# Altium schematic sheet E16-PDB-7-LOAD_3.SchDoc
size A4
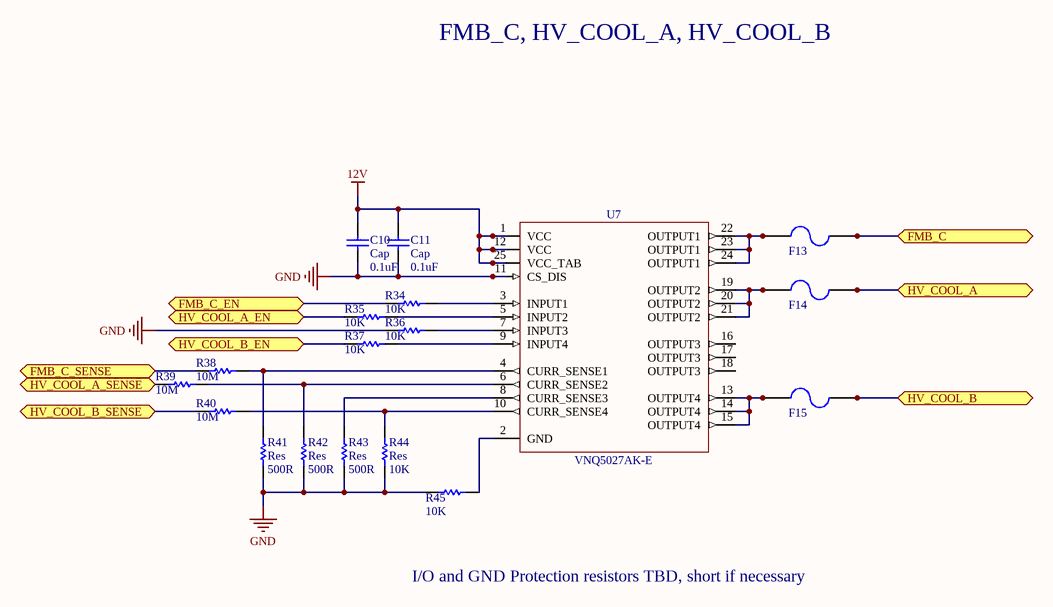
[diagram p0: E16-PDB-7-LOAD_3.SchDoc]

## Parts
C10  Cap  value 0.1uF  [C0805]
C11  Cap  value 0.1uF  [C0805]
F13  BK-6013  [BK-6013]  (value not drawn)
F14  BK-6013  [BK-6013]  (value not drawn)
F15  BK-6013  [BK-6013]  (value not drawn)
R34  value 10K  [2012[0805]]  (hidden comment: Res)
R35  value 10K  [2012[0805]]  (hidden comment: Res)
R36  value 10K  [2012[0805]]  (hidden comment: Res)
R37  value 10K  [2012[0805]]  (hidden comment: Res)
R38  value 10M  [2012[0805]]  (hidden comment: Res)
R39  value 10M  [2012[0805]]  (hidden comment: Res)
R40  value 10M  [2012[0805]]  (hidden comment: Res)
R41  Res  value 500R  [2012[0805]]
R42  Res  value 500R  [2012[0805]]
R43  Res  value 500R  [2012[0805]]
R44  Res  value 10K  [2012[0805]]
R45  value 10K  [2012[0805]]  (hidden comment: Res)
U7  MFG_PN: VNQ5027AK-E  [PowerSSO-24]  (hidden comment: U_VNQ5027AK-E)

## Ports
FMB_C, FMB_C_EN, FMB_C_SENSE, HV_COOL_A, HV_COOL_A_EN, HV_COOL_A_SENSE, HV_COOL_B, HV_COOL_B_EN, HV_COOL_B_SENSE

## Nets
12V: C10.2 C11.2 U7.1(VCC) U7.12(VCC) U7.25(VCC_TAB)
GND: C10.1 C11.1 R36.2 R41.1 R42.1 R43.1 R44.1 R45.2 U7.11(CS_DIS)
FMB_C: F13.3 F13.4 ; port FMB_C
FMB_C_EN: R34.2 ; port FMB_C_EN
FMB_C_SENSE: R38.2 ; port FMB_C_SENSE
HV_COOL_A: F14.3 F14.4 ; port HV_COOL_A
HV_COOL_A_EN: R35.2 ; port HV_COOL_A_EN
HV_COOL_A_SENSE: R39.2 ; port HV_COOL_A_SENSE
HV_COOL_B: F15.3 F15.4 ; port HV_COOL_B
HV_COOL_B_EN: R37.2 ; port HV_COOL_B_EN
HV_COOL_B_SENSE: R40.2 ; port HV_COOL_B_SENSE
NetF13_1: F13.1 F13.2 U7.22(OUTPUT1) U7.23(OUTPUT1) U7.24(OUTPUT1)
NetF14_1: F14.1 F14.2 U7.19(OUTPUT2) U7.20(OUTPUT2) U7.21(OUTPUT2)
NetF15_1: F15.1 F15.2 U7.13(OUTPUT4) U7.14(OUTPUT4) U7.15(OUTPUT4)
NetR34_1: R34.1 U7.3(INPUT1)
NetR35_1: R35.1 U7.5(INPUT2)
NetR36_1: R36.1 U7.7(INPUT3)
NetR37_1: R37.1 U7.9(INPUT4)
NetR38_1: R38.1 R41.2 U7.4(CURR_SENSE1)
NetR39_1: R39.1 R42.2 U7.6(CURR_SENSE2)
NetR40_1: R40.1 R44.2 U7.10(CURR_SENSE4)
NetR43_2: R43.2 U7.8(CURR_SENSE3)
NetR45_1: R45.1 U7.2(GND)

Not connected (* = marked no-connect by the designer): U7 16(OUTPUT3) 17(OUTPUT3) 18(OUTPUT3)

## Notes on the sheet
- FMB_C, HV_COOL_A, HV_COOL_B
- I/O and GND Protection resistors TBD, short if necessary

## Library data of the parts
C10 C11 = Cap: Capacitor; Published: 8-Jun-2000; LatestRevisionDate: 17-Jul-2002; LatestRevisionNote: Re-released for DXP Platform.; PackageReference: C1206; Publisher: Altium Limited
F13-F15 = BK-6013: FUSE HOLDER BLADE PCB; Supplier 1: Digi-Key; Supplier Part Number 1: BK-6013-ND
R34-R45 = Res: Surface Mount Resistor; Published: 8-Jun-2000; LatestRevisionDate: 17-Jul-2002; LatestRevisionNote: Re-released for DXP Platform.; PackageReference: AXIAL-0.5; Publisher: Altium Limited
U7 = U_VNQ5027AK-E: LOAD CHANNEL HIGH SIDE 42 A 4 Channel; MFG: STmicroelectronics; Supplier 1: Digi-Key; Supplier Part Number 1: 497-11715-1-ND